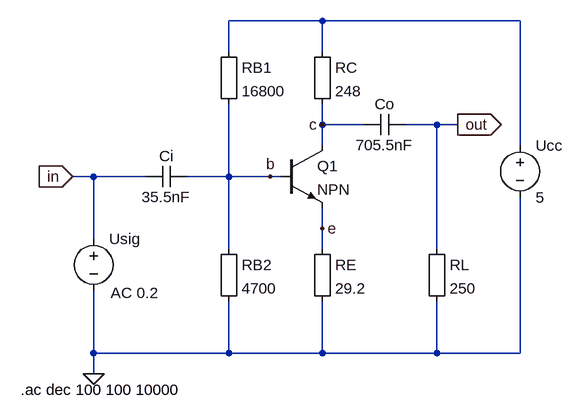
[diagram p0: schematic transistorivahvistin.asc]
transistorivahvistin.asc, the LTspice schematic file:
Version 4
SHEET 1 880 680
WIRE 160 -176 16 -176
WIRE 464 -176 160 -176
WIRE 16 -128 16 -176
WIRE 160 -128 160 -176
WIRE 160 -16 160 -48
WIRE 224 -16 160 -16
WIRE 336 -16 288 -16
WIRE 368 -16 336 -16
WIRE 160 16 160 -16
WIRE 464 16 464 -176
WIRE -192 64 -224 64
WIRE -112 64 -192 64
WIRE 16 64 16 -48
WIRE 16 64 -48 64
WIRE 80 64 16 64
WIRE 96 64 80 64
WIRE 160 144 160 112
WIRE -192 160 -192 64
WIRE 16 176 16 64
WIRE 160 176 160 144
WIRE 336 176 336 -16
WIRE -192 336 -192 240
WIRE 16 336 16 256
WIRE 16 336 -192 336
WIRE 160 336 160 256
WIRE 160 336 16 336
WIRE 336 336 336 256
WIRE 336 336 160 336
WIRE 464 336 464 96
WIRE 464 336 336 336
WIRE -192 368 -192 336
FLAG -192 368 0
FLAG 368 -16 out
IOPIN 368 -16 Out
FLAG -224 64 in
IOPIN -224 64 In
FLAG 160 -16 c
FLAG 80 64 b
FLAG 160 144 e
SYMBOL npn 96 16 R0
SYMATTR InstName Q1
SYMBOL voltage 464 0 R0
WINDOW 123 0 0 Left 2
WINDOW 39 0 0 Left 2
SYMATTR InstName Ucc
SYMATTR Value 5
SYMBOL voltage -192 144 R0
WINDOW 123 26 99 Left 2
WINDOW 39 0 0 Left 2
SYMATTR Value2 AC 0.2
SYMATTR InstName Usig
SYMATTR Value ""
SYMBOL cap -48 48 R90
WINDOW 0 0 32 VBottom 2
WINDOW 3 32 32 VTop 2
SYMATTR InstName Ci
SYMATTR Value 35.5nF
SYMBOL Misc\\EuropeanResistor 0 160 R0
SYMATTR InstName RB2
SYMATTR Value 4700
SYMBOL Misc\\EuropeanResistor 144 160 R0
SYMATTR InstName RE
SYMATTR Value 29.2
SYMBOL Misc\\EuropeanResistor 320 160 R0
SYMATTR InstName RL
SYMATTR Value 250
SYMBOL Misc\\EuropeanResistor 144 -144 R0
SYMATTR InstName RC
SYMATTR Value 248
SYMBOL Misc\\EuropeanResistor 0 -144 R0
SYMATTR InstName RB1
SYMATTR Value 16800
SYMBOL cap 288 -32 R90
WINDOW 0 0 32 VBottom 2
WINDOW 3 32 32 VTop 2
SYMATTR InstName Co
SYMATTR Value 705.5nF
TEXT -304 392 Left 2 !.ac dec 100 100 10000

The netlist it stands for:
* transistorivahvistin.asc
Q1 c b e 0 NPN
V§Ucc N001 0 5
V§Usig in 0 AC 0.2
Ci b in 35.5nF
RB2 b 0 4700
RE e 0 29.2
RL out 0 250
RC N001 c 248
RB1 N001 b 16800
Co out c 705.5nF
.model NPN NPN
.model PNP PNP
.lib standard.bjt
.ac dec 100 100 10000
.backanno
.end